# Altium schematic sheet eth_part.SchDoc
size A3
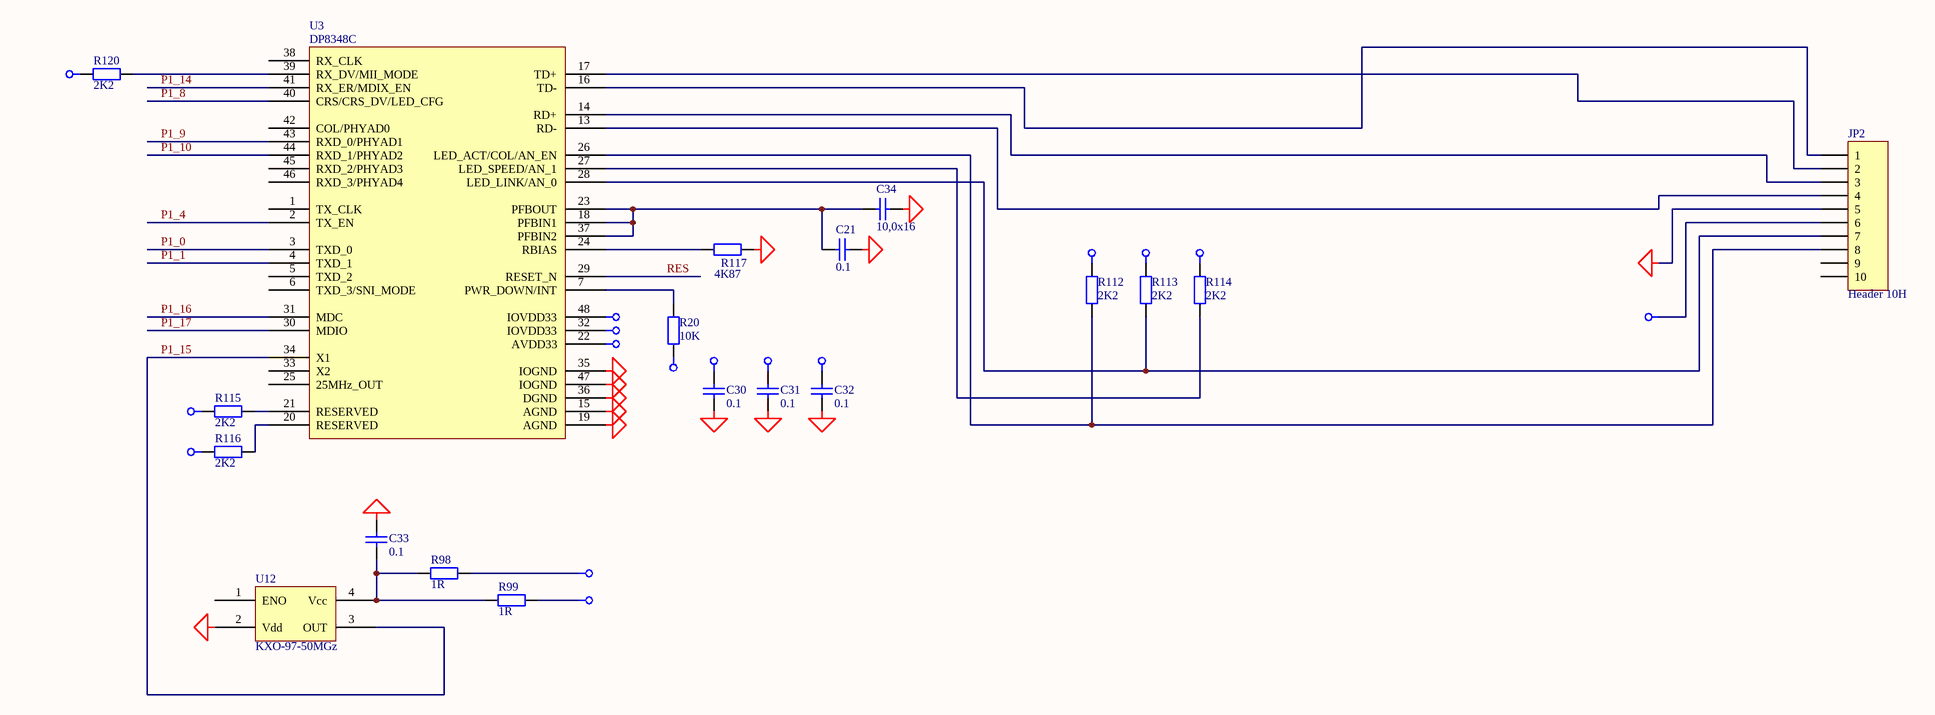
[diagram p0: eth_part.SchDoc]

## Parts
C21  0.1  [C3216-1206]
C30  0.1  [_1206]
C31  0.1  [_1206]
C32  0.1  [_1206]
C33  0.1  [_1206]
C34  10,0x16  [C3216-1206]
JP2  Header 10H  [HDR2X5]
R20  10K  [_1206]
R98  1R  [_1206]
R99  1R  [_1206]
R112  2K2  [_1206]
R113  2K2  [_1206]
R114  2K2  [_1206]
R115  2K2  [_1206]
R116  2K2  [_1206]
R117  4K87  [_1206]
R120  2K2  [_1206]
U3  DP8348C  [F-QFP7X7-G48/N]
U12  KXO-97-50MGz  [KXO-97]

## Nets
+3v3: C30.1 C31.1 C32.1 JP2.6 R20.2 R99.2 R112.2 R113.2 R114.2 R115.2 R116.2 R120.2 U3.22(AVDD33) U3.32(IOVDD33) U3.48(IOVDD33)
+5v: R98.2
GND: C21.2 C30.2 C31.2 C32.2 C33.2 C34.2 JP2.5 R117.1 U3.15(AGND) U3.19(AGND) U3.35(IOGND) U3.36(DGND) U3.47(IOGND) U12.2(Vdd)
P1_0: U3.3(TXD_0)
P1_1: U3.4(TXD_1)
P1_4: U3.2(TX_EN)
P1_8: U3.40(CRS/CRS_DV/LED_CFG)
P1_9: U3.43(RXD_0/PHYAD1)
P1_10: U3.44(RXD_1/PHYAD2)
P1_14: U3.41(RX_ER/MDIX_EN)
P1_15: U3.34(X1) U12.3(OUT)
P1_16: U3.31(MDC)
P1_17: U3.30(MDIO)
RES: U3.29(RESET_N)
NetC21_1: C21.1 C34.1 U3.18(PFBIN1) U3.23(PFBOUT) U3.37(PFBIN2)
NetC33_1: C33.1 R98.1 R99.1 U12.4(Vcc)
NetJP2_1: JP2.1 U3.16(TD-)
NetJP2_2: JP2.2 U3.17(TD+)
NetJP2_3: JP2.3 U3.14(RD+)
NetJP2_4: JP2.4 U3.13(RD-)
NetJP2_7: JP2.7 R113.1 U3.28(LED_LINK/AN_0)
NetJP2_8: JP2.8 R112.1 U3.26(LED_ACT/COL/AN_EN)
NetR20_1: R20.1 U3.7(PWR_DOWN/INT)
NetR114_1: R114.1 U3.27(LED_SPEED/AN_1)
NetR115_1: R115.1 U3.21(RESERVED)
NetR116_1: R116.1 U3.20(RESERVED)
NetR117_2: R117.2 U3.24(RBIAS)
NetR120_1: R120.1 U3.39(RX_DV/MII_MODE)

Not connected (* = marked no-connect by the designer): JP2 9 10; U3 1(TX_CLK) 5(TXD_2) 6(TXD_3/SNI_MODE) 25(25MHz_OUT) 33(X2) 38(RX_CLK) 42(COL/PHYAD0) 45(RXD_2/PHYAD3) 46(RXD_3/PHYAD4); U12 1(ENO)

## Library data of the parts
C21 C30-C34 = Cap Semi: Capacitor (Semiconductor SIM Model); Manufacturer: Generic Components; Class I: Passive; Value: 1,0; Published: 8-Jun-2000; Revision: July-2002: Re-released for DXP Platform.; Publisher: Altium Limited; Class II: Capacitor
JP2 = Header 10H: Header, 10-Pin, Right Angle; Manufacturer: Generic Components; Class I: Connector; Revision: July-2002: Re-released for DXP Platform.; Publisher: Altium Limited
R20 = Res2: Resistor; Manufacturer: Generic Components; Class I: Passive; Rule: Undefined; Published: 8-Jun-2000; Revision: July-2002: Re-released for DXP Platform.; Publisher: Altium Limited; Class II: Resistor; Value: 10K
R98 R99 R112-R117 R120 = Res2: Resistor; Manufacturer: Generic Components; Class I: Passive; Value: 10K; Rule: Undefined; Published: 8-Jun-2000; Revision: July-2002: Re-released for DXP Platform.; Publisher: Altium Limited; Class II: Resistor
U12 = KXO-97